# EasyEDA schematic 1.json
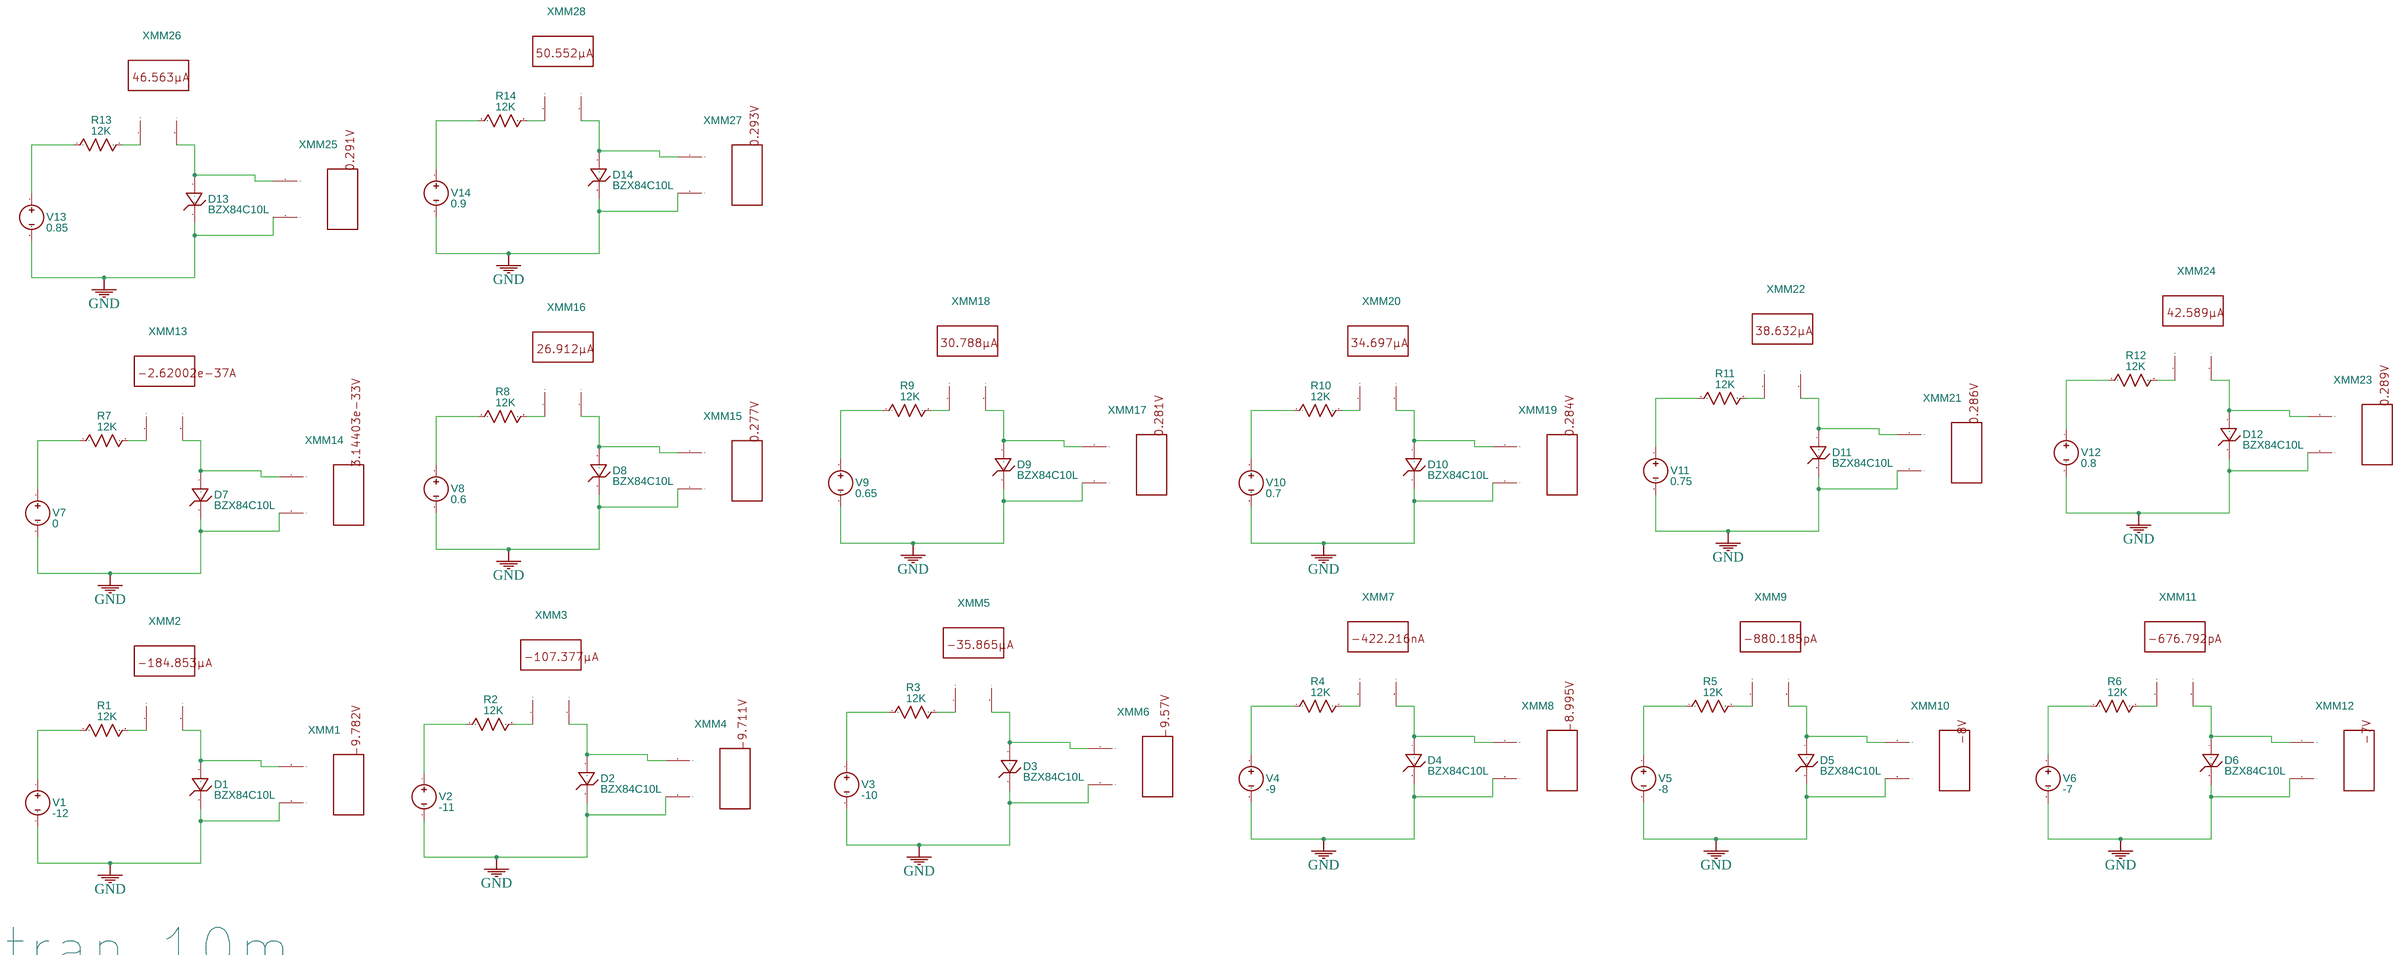
[diagram p0: schematic sheet]

## Parts
D1  BZX84C10L  [SMB]
D2  BZX84C10L  [SMB]
D3  BZX84C10L  [SMB]
D4  BZX84C10L  [SMB]
D5  BZX84C10L  [SMB]
D6  BZX84C10L  [SMB]
D7  BZX84C10L  [SMB]
D8  BZX84C10L  [SMB]
D9  BZX84C10L  [SMB]
D10  BZX84C10L  [SMB]
D11  BZX84C10L  [SMB]
D12  BZX84C10L  [SMB]
D13  BZX84C10L  [SMB]
D14  BZX84C10L  [SMB]
R1  12K  [AXIAL-0.3]
R2  12K  [AXIAL-0.3]
R3  12K  [AXIAL-0.3]
R4  12K  [AXIAL-0.3]
R5  12K  [AXIAL-0.3]
R6  12K  [AXIAL-0.3]
R7  12K  [AXIAL-0.3]
R8  12K  [AXIAL-0.3]
R9  12K  [AXIAL-0.3]
R10  12K  [AXIAL-0.3]
R11  12K  [AXIAL-0.3]
R12  12K  [AXIAL-0.3]
R13  12K  [AXIAL-0.3]
R14  12K  [AXIAL-0.3]
V1  -12  [HDR1X2]
V2  -11  [HDR1X2]
V3  -10  [HDR1X2]
V4  -9  [HDR1X2]
V5  -8  [HDR1X2]
V6  -7  [HDR1X2]
V7  0  [HDR1X2]
V8  0.6  [HDR1X2]
V9  0.65  [HDR1X2]
V10  0.7  [HDR1X2]
V11  0.75  [HDR1X2]
V12  0.8  [HDR1X2]
V13  0.85  [HDR1X2]
V14  0.9  [HDR1X2]
XMM1  Multimeter
XMM2  Multimeter
XMM3  Multimeter
XMM4  Multimeter
XMM5  Multimeter
XMM6  Multimeter
XMM7  Multimeter
XMM8  Multimeter
XMM9  Multimeter
XMM10  Multimeter
XMM11  Multimeter
XMM12  Multimeter
XMM13  Multimeter
XMM14  Multimeter
XMM15  Multimeter
XMM16  Multimeter
XMM17  Multimeter
XMM18  Multimeter
XMM19  Multimeter
XMM20  Multimeter
XMM21  Multimeter
XMM22  Multimeter
XMM23  Multimeter
XMM24  Multimeter
XMM25  Multimeter
XMM26  Multimeter
XMM27  Multimeter
XMM28  Multimeter

## Library data of the parts
D1-D14 = BZX84C10L: Contributor: EasyEDA
R1-R14 = Resistor_US: Resistance: 1k; Contributor: EasyEDA; Supplier: YUJING
V1-V14 = VDC: Contributor: EasyEDA; sim: true
XMM1 XMM4 XMM6 XMM8 XMM10 XMM12 XMM14 XMM15 XMM17 XMM19 XMM21 XMM23 XMM25 XMM27 = MULTIMETER: Supplier: LCSC; Multimeter Type: Voltmeter; Power Type: AC; Voltmeter resistance: 10μ; Ammeter resistance: 1G; NameDisplay: 0; Contributor: EasyEDA; sim: true
XMM2 XMM3 XMM5 XMM7 XMM9 XMM11 XMM13 XMM16 XMM18 XMM20 XMM22 XMM24 XMM26 XMM28 = MULTIMETER: Supplier: LCSC; Multimeter Type: Amper; Power Type: AC; Voltmeter resistance: 10μ; Ammeter resistance: 1G; NameDisplay: 0; Contributor: EasyEDA; sim: true

## Nets
GND: D1.2(K) D2.2(K) D3.2(K) D4.2(K) D5.2(K) D6.2(K) D7.2(K) D8.2(K) D9.2(K) D10.2(K) D11.2(K) D12.2(K) D13.2(K) D14.2(K) V1.2 V2.2 V3.2 V4.2 V5.2 V6.2 V7.2 V8.2 V9.2 V10.2 V11.2 V12.2 V13.2 V14.2 XMM1.2(I) XMM4.2(I) XMM6.2(I) XMM8.2(I) XMM10.2(I) XMM12.2(I) XMM14.2(I) XMM15.2(I) XMM17.2(I) XMM19.2(I) XMM21.2(I) XMM23.2(I) XMM25.2(I) XMM27.2(I)
Net-(D1-1): D1.1(A) XMM1.1(+) XMM2.2(I)
Net-(D2-1): D2.1(A) XMM3.2(I) XMM4.1(+)
Net-(D3-1): D3.1(A) XMM5.2(I) XMM6.1(+)
Net-(D4-1): D4.1(A) XMM7.2(I) XMM8.1(+)
Net-(D5-1): D5.1(A) XMM9.2(I) XMM10.1(+)
Net-(D6-1): D6.1(A) XMM11.2(I) XMM12.1(+)
Net-(D7-1): D7.1(A) XMM13.2(I) XMM14.1(+)
Net-(D8-1): D8.1(A) XMM15.1(+) XMM16.2(I)
Net-(D9-1): D9.1(A) XMM17.1(+) XMM18.2(I)
Net-(D10-1): D10.1(A) XMM19.1(+) XMM20.2(I)
Net-(D11-1): D11.1(A) XMM21.1(+) XMM22.2(I)
Net-(D12-1): D12.1(A) XMM23.1(+) XMM24.2(I)
Net-(D13-1): D13.1(A) XMM25.1(+) XMM26.2(I)
Net-(D14-1): D14.1(A) XMM27.1(+) XMM28.2(I)
Net-(R1-1): R1.1 V1.1
Net-(R1-2): R1.2 XMM2.1(+)
Net-(R2-1): R2.1 V2.1
Net-(R2-2): R2.2 XMM3.1(+)
Net-(R3-1): R3.1 V3.1
Net-(R3-2): R3.2 XMM5.1(+)
Net-(R4-1): R4.1 V4.1
Net-(R4-2): R4.2 XMM7.1(+)
Net-(R5-1): R5.1 V5.1
Net-(R5-2): R5.2 XMM9.1(+)
Net-(R6-1): R6.1 V6.1
Net-(R6-2): R6.2 XMM11.1(+)
Net-(R7-1): R7.1 V7.1
Net-(R7-2): R7.2 XMM13.1(+)
Net-(R8-1): R8.1 V8.1
Net-(R8-2): R8.2 XMM16.1(+)
Net-(R9-1): R9.1 V9.1
Net-(R9-2): R9.2 XMM18.1(+)
Net-(R10-1): R10.1 V10.1
Net-(R10-2): R10.2 XMM20.1(+)
Net-(R11-1): R11.1 V11.1
Net-(R11-2): R11.2 XMM22.1(+)
Net-(R12-1): R12.1 V12.1
Net-(R12-2): R12.2 XMM24.1(+)
Net-(R13-1): R13.1 V13.1
Net-(R13-2): R13.2 XMM26.1(+)
Net-(R14-1): R14.1 V14.1
Net-(R14-2): R14.2 XMM28.1(+)

## Notes on the sheet
- .tran 10m
